# Altium project iron_board.PrjPcb
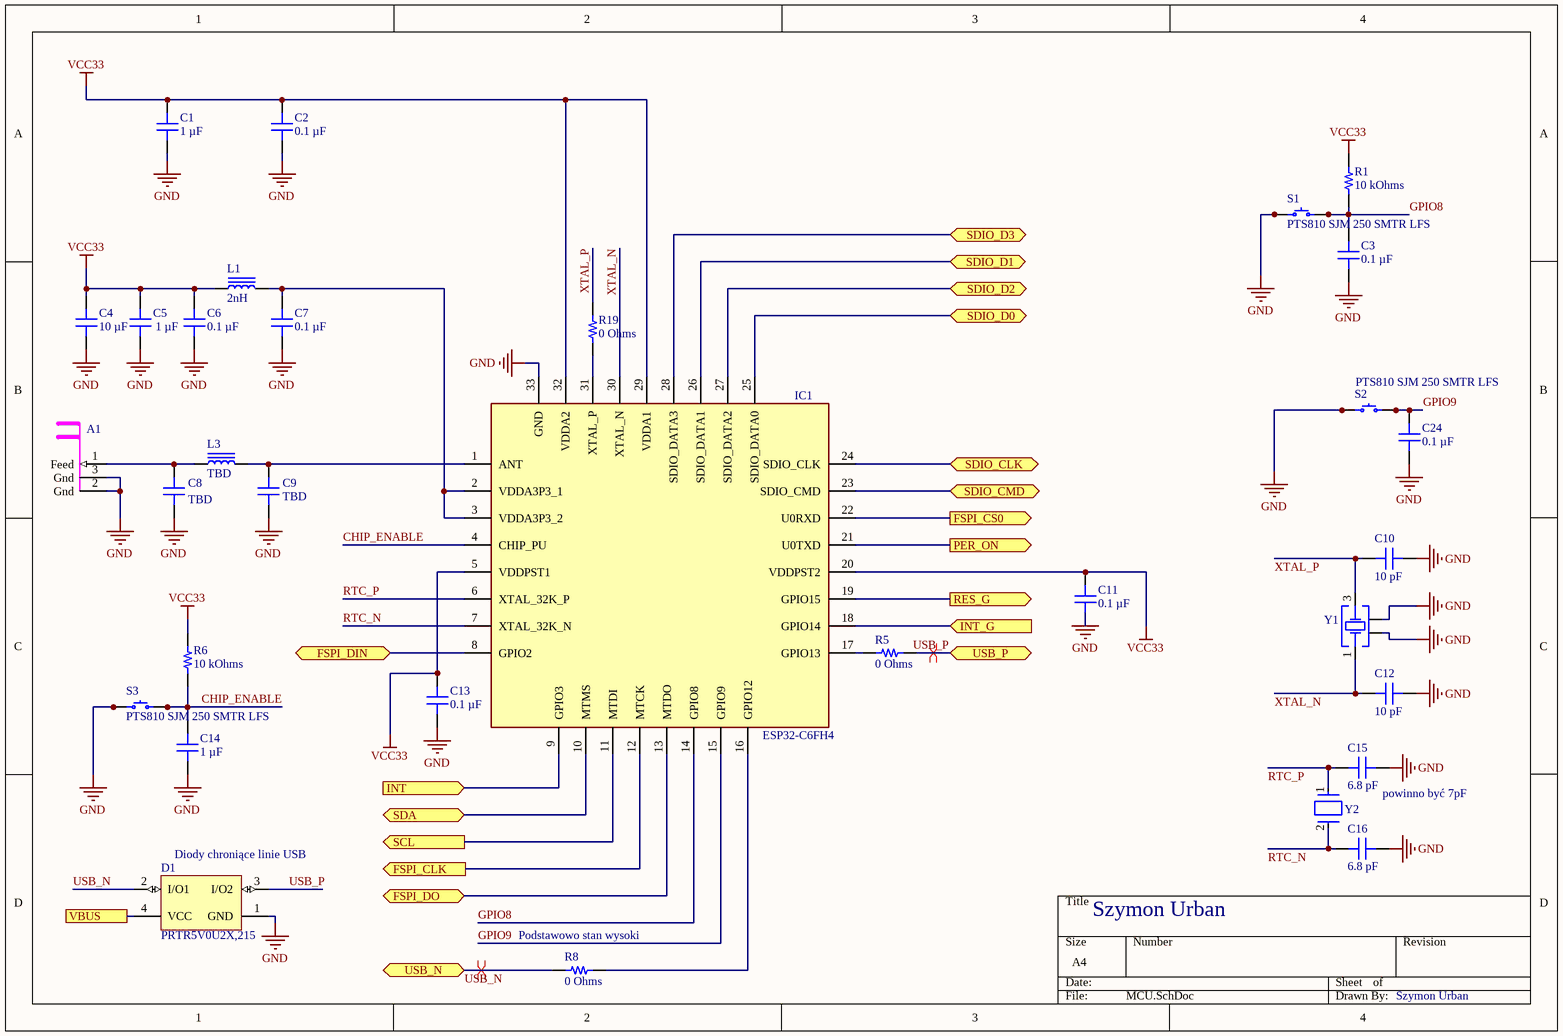
[diagram p0: MCU.SchDoc]
2 sheets, 76 parts. Net scope: flat (ports and power ports of the same name join across sheets).
Board file: iron_board_PCB.PcbDoc
Sheets:
  MCU.SchDoc
  peripherals.SchDoc

## Sheet MCU.SchDoc
size A4; SheetNumber: 1; SheetTotal: 2

### Parts
A1  Inverted F Antenna 2.4GHz  [IFA_2.4GHz]  (value not drawn)  (net tie, no BOM)
C1  1 µF  [CAP 0603_1608]
C2  0.1 µF  [CAP 0603_1608]
C3  0.1 µF  [CAP 0603_1608]
C4  10 µF  [CAP 0603_1608]
C5  1 µF  [CAP 0603_1608]
C6  0.1 µF  [CAP 0603_1608]
C7  0.1 µF  [CAP 0603_1608]
C8  TBD  [CAP 0402_1005]
C9  TBD  [CAP 0402_1005]
C10  10 pF  [CAP 0603_1608]
C11  0.1 µF  [CAP 0603_1608]
C12  10 pF  [CAP 0603_1608]
C13  0.1 µF  [CAP 0603_1608]
C14  1 µF  [CAP 0603_1608]
C15  6.8 pF  [CAP 0603_1608]
C16  6.8 pF  [CAP 0603_1608]
C24  0.1 µF  [CAP 0603_1608]
D1  PRTR5V0U2X,215  [NXP-SOT143B-4_V]
IC1  ESP32-C6FH4  [QFN50P500X500X90-33N]
L1  2nH  [IND 0603_1608 RF WW]
L3  TBD  [IND 0402_1005 RF WW]
R1  10 kOhms  [RES 0603_1608]
R5  0 Ohms  [RES 0603_1608]
R6  10 kOhms  [RES 0603_1608]
R8  0 Ohms  [RES 0603_1608]
R19  0 Ohms  [RES 0603_1608]
S1  PTS810 SJM 250 SMTR LFS  [C&K PTS810]
S2  PTS810 SJM 250 SMTR LFS  [C&K PTS810]
S3  PTS810 SJM 250 SMTR LFS  [C&K PTS810]
Y1  830108208709  [WE-XTAL_CFPX-218]  (value not drawn)
Y2  ABS07-32.768KHZ-7-1-T  [FP-ABS07-MFG]  (value not drawn)

### Ports
FSPI_CLK (out, see peripherals[2D]), FSPI_CS0 (out, see peripherals[2D]), FSPI_DIN (bidir, see peripherals[2D]), FSPI_DO (bidir, see peripherals[2D]), INT (in, see peripherals[4C]), INT_G (in, see peripherals[2C]), PER_ON (out, see peripherals[1D]), RES_G (out, see peripherals[2C]), SCL (out, see peripherals[2C], peripherals[3D]), SDA (bidir, see peripherals[2C], peripherals[3D]), SDIO_CLK (bidir, see peripherals[4B]), SDIO_CMD (bidir, see peripherals[4B]), SDIO_D0 (bidir, see peripherals[4A]), SDIO_D1 (bidir, see peripherals[4A]), SDIO_D2 (bidir, see peripherals[4A]), SDIO_D3 (bidir, see peripherals[4B]), USB_N (bidir, see peripherals[3A], peripherals[3B]), USB_P (bidir, see peripherals[3A], peripherals[3B]), VBUS (see peripherals[1A], peripherals[3A])

### Nets
GND: A1.2(Gnd) A1.3(Gnd) C1.1 C2.1 C3.1 C4.2 C5.1 C6.1 C7.1 C8.1 C9.1 C10.2 C11.1 C12.2 C13.1 C14.1 C15.2 C16.2 C24.1 D1.1(GND) IC1.33(GND) S1.1 S1.2 S2.1 S2.2 S3.1 S3.2 Y1.2(GND) Y1.4(GND)
VCC33: C1.2 C2.2 C4.1 C5.2 C6.2 C11.2 C13.2 IC1.5(VDDPST1) IC1.20(VDDPST2) IC1.29(VDDA1) IC1.32(VDDA2) L1.1 R1.2 R6.2
CHIP_ENABLE: C14.2 IC1.4(CHIP_PU) R6.1 S3.3 S3.4
GPIO8: C3.2 IC1.14(GPIO8) R1.1 S1.3 S1.4
GPIO9: C24.2 IC1.15(GPIO9) S2.3 S2.4
INT: IC1.9(GPIO3) ; port INT
INT_G: IC1.18(GPIO14) ; port INT_G
RTC_N: C16.1 IC1.7(XTAL_32K_N) Y2.2
RTC_P: C15.1 IC1.6(XTAL_32K_P) Y2.1
SCL: IC1.11(MTDI) ; port SCL
SDA: IC1.10(MTMS) ; port SDA
USB_N: D1.2(I/O1) R8.2 ; port USB_N
USB_P: D1.3(I/O2) R5.1 ; port USB_P
VBUS: D1.4(VCC) ; port VBUS
XTAL_N: C12.1 IC1.30(XTAL_N) Y1.1(Crystal)
XTAL_P: C10.1 R19.1 Y1.3(Crystal)
NetA1_1: A1.1(Feed) C8.2 L3.1
NetC7_2: C7.2 IC1.2(VDDA3P3_1) IC1.3(VDDA3P3_2) L1.2
NetC9_2: C9.2 IC1.1(ANT) L3.2
NetIC1_8: IC1.8(GPIO2) ; port FSPI_DIN
NetIC1_12: IC1.12(MTCK) ; port FSPI_CLK
NetIC1_13: IC1.13(MTDO) ; port FSPI_DO
NetIC1_16: IC1.16(GPIO12) R8.1
NetIC1_17: IC1.17(GPIO13) R5.2
NetIC1_19: IC1.19(GPIO15) ; port RES_G
NetIC1_21: IC1.21(U0TXD) ; port PER_ON
NetIC1_22: IC1.22(U0RXD) ; port FSPI_CS0
NetIC1_23: IC1.23(SDIO_CMD) ; port SDIO_CMD
NetIC1_24: IC1.24(SDIO_CLK) ; port SDIO_CLK
NetIC1_25: IC1.25(SDIO_DATA0) ; port SDIO_D0
NetIC1_26: IC1.26(SDIO_DATA1) ; port SDIO_D1
NetIC1_27: IC1.27(SDIO_DATA2) ; port SDIO_D2
NetIC1_28: IC1.28(SDIO_DATA3) ; port SDIO_D3
NetIC1_31: IC1.31(XTAL_P) R19.2

### Layout directives
differential pair; net class USB_P: USB_N
differential pair: USB_P

### Notes on the sheet
- (near C15) powinno być 7pF
- (near D1) Diody chroniące linie USB
- Szymon Urban
- (near R8) Podstawowo stan wysoki

### Library data of the parts
A1 = IFA_2.4GHz
C1 C5 C14 = CC0603KRX7R6BB105: CAP CER 1UF 10V X7R 0603; manufacturer: Yageo; Tolerance: ±10%; Part Number: CC0603KRX7R6BB105; Value: 1 µF; Applications: General Purpose; Capacitance: 1 µF; componentlink1description: Datasheet; componentlink1url: https://www.yageo.com/upload/media/product/productsearch/datasheet/mlcc/UPY-GPHC_X7R_6.3V-to-50V_18.pdf; componentlink2description: DigiKey Link; componentlink2url: https://www.digikey.com/en/products/detail/yageo/CC0603KRX7R6BB105/5195204; Device Package: 0603 (1608 Metric); lastupdated: 15.01.2024 20:10:05; Lifecycle Status: Active; Minimum Order: 1; Mounting Type: Surface Mount, MLCC; Operating Temperature: -55°C ~ 125°C; Package / Case: 0603 (1608 Metric); packaging: TapeAndReel; partid: 2290; Part Status: Active; price: 0.01; series: CC; Size / Dimension: 0.063" L x 0.031" W (1.60mm x 0.80mm); Supplier 1: DigiKey; Supplier Part Number 1: 311-1796-1-ND; Temperature Coefficient: X7R; Thickness (Max): 0.035" (0.90mm); Voltage - Rated: 10V
C2 C3 C6 C7 C11 C13 C24 = CS0603KRX7R7BB104: CAP CER 0.1UF 16V X7R 0603; manufacturer: Yageo; Tolerance: ±10%; Part Number: CS0603KRX7R7BB104; Value: 0.1 µF; Applications: Boardflex Sensitive; Capacitance: 0.1 µF; componentlink1description: Datasheet; componentlink1url: http://www.yageo.com/NewPortal/yageodocoutput?fileName=/pdf/MLCC/UPY-ST_NPOX7R_16V-to-3KV_5.pdf; componentlink2description: DigiKey Link; componentlink2url: https://www.digikey.com/en/products/detail/yageo/CS0603KRX7R7BB104/6097897; Device Package: 0603 (1608 Metric); Features: Soft Termination; lastupdated: 15.01.2024 20:10:05; Lifecycle Status: Active; Minimum Order: 1; Mounting Type: Surface Mount, MLCC; Operating Temperature: -55°C ~ 125°C; Package / Case: 0603 (1608 Metric); packaging: TapeAndReel; partid: 2286; Part Status: Active; price: 0.01; series: CS; Size / Dimension: 0.063" L x 0.031" W (1.60mm x 0.80mm); Supplier 1: DigiKey; Supplier Part Number 1: 311-3560-1-ND; Temperature Coefficient: X7R; Thickness (Max): 0.037" (0.95mm); Voltage - Rated: 16V
C4 = GRM188D71A106KA73D: CAP CER 10UF 10V X7T 0603; manufacturer: Murata Electronics; Tolerance: ±10%; Part Number: GRM188D71A106KA73D; Value: 10 µF; Applications: General Purpose; Capacitance: 10 µF; componentlink1description: Datasheet; componentlink1url: https://search.murata.co.jp/Ceramy/image/img/A01X/G101/ENG/GRM188D71A106KA73-01.pdf; componentlink2description: DigiKey Link; componentlink2url: https://www.digikey.com/en/products/detail/murata-electronics/GRM188D71A106KA73D/6606090; Device Package: 0603 (1608 Metric); lastupdated: 15.01.2024 20:10:04; Lifecycle Status: Active; Minimum Order: 1; Mounting Type: Surface Mount, MLCC; Operating Temperature: -55°C ~ 125°C; Package / Case: 0603 (1608 Metric); packaging: TapeAndReel; partid: 2489; Part Status: Active; price: 0.03; series: GRM; Size / Dimension: 0.063" L x 0.031" W (1.60mm x 0.80mm); Supplier 1: DigiKey; Supplier Part Number 1: 490-14461-1-ND; Temperature Coefficient: X7T; Thickness (Max): 0.039" (1.00mm); Voltage - Rated: 10V
C8 C9 = 04023A6R8CAT2A: CAP CER 6.8PF 25V C0G/NP0 0402; manufacturer: AVX Corporation; Temperature Coefficient: C0G, NP0; Tolerance: ±0.25pF; Part Number: 04023A6R8CAT2A; Value: TBD; Applications: General Purpose; componentlink1description: Datasheet; componentlink1url: http://datasheets.avx.com/C0GNP0-Dielectric.pdf; componentlink2description: DigiKey Link; componentlink2url: http://digikey.com/product-detail/en/avx-corporation/04023A6R8CAT2A/478-12617-1-ND/9949155; Device Package: 0402 (1005 Metric); lastupdated: 08.02.2022 12:26:50; Lifecycle Status: Active; Minimum Order: 1; Mounting Type: Surface Mount, MLCC; Operating Temperature: -55°C ~ 125°C; Package / Case: 0402 (1005 Metric); packaging: TapeAndReel; partid: 6987; Part Status: Active; price: 0.06; series: -; Size / Dimension: 0.039" L x 0.020" W (1.00mm x 0.50mm); Supplier 1: DigiKey; Supplier Part Number 1: 478-12617-1-ND; Thickness (Max): 0.022" (0.56mm); Voltage - Rated: 25V
  C8: Capacitance: TBD
  C9: Capacitance: 6.8pF
C10 C12 = VJ0603A100FXACW1BC: CAP CER 10PF 50V C0G/NP0 0603; manufacturer: Vishay Vitramon; Temperature Coefficient: C0G, NP0; Tolerance: ±1%; Part Number: VJ0603A100FXACW1BC; Value: 10 pF; Applications: General Purpose; Capacitance: 10 pF; componentlink1description: Datasheet; componentlink1url: https://www.vishay.com/docs/28548/vjw1bcbascomseries.pdf; componentlink2description: DigiKey Link; componentlink2url: https://www.digikey.com/en/products/detail/vishay-vitramon/VJ0603A100FXACW1BC/8302770; Device Package: 0603 (1608 Metric); lastupdated: 15.01.2024 20:09:38; Lifecycle Status: Active; Minimum Order: 1; Mounting Type: Surface Mount, MLCC; Operating Temperature: -55°C ~ 125°C; Package / Case: 0603 (1608 Metric); packaging: TapeAndReel; partid: 42121; Part Status: Active; price: 0.01; series: VJ W1BC; Size / Dimension: 0.063" L x 0.031" W (1.60mm x 0.80mm); Supplier 1: DigiKey; Supplier Part Number 1: 720-VJ0603A100FXACW1BCCT-ND; Thickness (Max): 0.034" (0.87mm); Voltage - Rated: 50V
C15 C16 = GQM1875C2E6R8WB12D: CAP CER 6.8PF 250V C0G/NP0 0603; manufacturer: Murata Electronics; Temperature Coefficient: C0G, NP0; Tolerance: ±0.05pF; Part Number: GQM1875C2E6R8WB12D; Value: 6.8 pF; Applications: RF, Microwave, High Frequency; Capacitance: 6.8 pF; componentlink1description: Datasheet; componentlink1url: https://search.murata.co.jp/Ceramy/image/img/A01X/G101/ENG/GQM1875C2E6R8WB12-01.pdf; componentlink2description: DigiKey Link; componentlink2url: https://www.digikey.com/en/products/detail/murata-electronics/GQM1875C2E6R8WB12D/16033646; Device Package: 0603 (1608 Metric); Features: High Q, Low Loss; lastupdated: 15.01.2024 20:09:09; Lifecycle Status: Active; Minimum Order: 1; Mounting Type: Surface Mount, MLCC; Operating Temperature: -55°C ~ 125°C; Package / Case: 0603 (1608 Metric); packaging: TapeAndReel; partid: 50061; Part Status: Active; price: 0.11; series: GQM; Size / Dimension: 0.063" L x 0.031" W (1.60mm x 0.80mm); Supplier 1: DigiKey; Supplier Part Number 1: 490-GQM1875C2E6R8WB12DCT-ND; Thickness (Max): 0.031" (0.80mm); Voltage - Rated: 250V
D1 = CMP-2000-05285-1: Ultra Low Capacitance Double Rail-to-Rail ESD Protection Diode, 5.5 V, 1 pF, -40 to 85 degC, 4-Pin SOT143B, RoHS, Tape and Reel; Manufacturer: NXP Semiconductors; Capacitance Value: 16pF; Number of Elements: 1; Rad Hardened: No; Reverse Breakdown Voltage: 6V; Working Voltage (Max): 5.5V; Polarity: Uni-Directional; Configuration: Quad; Leakage Current: 0.1uA; Product Height (mm): 1mm; Suppressor Type: DiodeArrays; Product Length (mm): 3mm; Product Depth (mm): 1.4mm; ESD Protection Voltage: 8KV@ContactDisc; Package Type: SOT; Mounting: SurfaceMount; Packaging: TapeandReel; Datasheet Version: Rev. 02, 01/2008; Reverse Stand-off Voltage: 5.5V; Manufacturer URL: http://www.nxp.com/; Operating Temp Range: -40Cto85C; Operating Temperature Classification: Industrial; Working Voltage: 5.5V; Operating Temperature Min Deg. C: -40C; Datasheet URL: https://datasheet.ciiva.com/4479/prtr5v0u2x-102853-4479461.pdf; Leakage Current (Max): 0.1uA; Direction Type: Uni-Directional; Pin Count: 3+Tab; Operating Temperature Max Deg. C: 85C; Mounting Style: SurfaceMount; Package / Case: SOT
IC1 = ESP32-C6FH4: Integrated Circuit; Manufacturer_Name: Espressif Systems; Datasheet Link: https://www.mouser.ch/ProductDetail/Espressif-Systems/ESP32-C6FH4?qs=sGAEpiMZZMu3sxpa5v1qriveB5Rxa06Y9iJOmwW58jU%3D; Height: 0.9mm; Manufacturer_Part_Number: ESP32-C6FH4; Mouser Part Number: 356-ESP32-C6FH4; Mouser Price/Stock: https://www.mouser.co.uk/ProductDetail/Espressif-Systems/ESP32-C6FH4?qs=Imq1NPwxi77uZvg%252BuAIiXA%3D%3D
L1 = 744761020A: FIXED IND 2NH 700MA 80 MOHM SMD; Manufacturer: Würth Elektronik; DC Resistance (DCR): 80mOhm Max; Frequency - Self Resonant: 6.9GHz; Inductance Frequency - Test: 250MHz; Material - Core: Ceramic; Q @ Freq: 16 @ 250MHz; Shielding: Unshielded; Tolerance: ±0.2nH; Type: Wirewound; Part Number: 744761020A; ComponentLink1Description: Datasheet; ComponentLink1URL: https://katalog.we-online.com/pbs/datasheet/744761020A.pdf; ComponentLink2Description: DigiKey Link; ComponentLink2URL: http://digikey.com/product-detail/en/w-rth-elektronik/744761020A/732-744761020ACT-ND/10668665; Current Rating (Amps): 700mA; Device Package: 0603 (1608 Metric); Inductance: 2nH; LastUpdated: 06.09.2020 11:05:18; Lifecycle Status: Active; Minimum Order: 1; Mounting Type: Surface Mount; Operating Temperature: -40°C ~ 125°C; Package / Case: 0603 (1608 Metric); Packaging: Unknown; PartId: 1038; Part Status: Active; Price: 0.18; Series: WE-KI; Supplier 1: DigiKey; Supplier Part Number 1: 732-744761020ACT-ND; Supplier Device Package: 0603; Value: 2nH
L3 = LQW18ASR39J00D: FIXED IND 390NH 100MA 4.35OHM SM; Manufacturer: Murata Electronics; DC Resistance (DCR): 4.35Ohm Max; Frequency - Self Resonant: 900MHz; Inductance Frequency - Test: 100 MHz; Material - Core: Non-Magnetic; Q @ Freq: 25 @ 100MHz; Shielding: Unshielded; Tolerance: ±5%; Type: Wirewound; Part Number: LQW18ASR39J00D; ComponentLink2Description: DigiKey Link; ComponentLink2URL: https://www.digikey.com/en/products/detail/murata-electronics/LQW18ASR39J00D/10702651; Current Rating (Amps): 100 mA; Device Package: 0603 (1608 Metric); Height - Seated (Max): 0.039" (1.00mm); Inductance: 390 nH; LastUpdated: 15.01.2024 21:33:43; Lifecycle Status: Active; Minimum Order: 1; Mounting Type: Surface Mount; Operating Temperature: -40°C ~ 125°C; Package / Case: 0603 (1608 Metric); Packaging: TapeAndReel; PartId: 1604; Part Status: Active; Price: 0.05; Series: LQW15; Size / Dimension: 0.063" L x 0.031" W (1.60mm x 0.80mm); Supplier 1: DigiKey; Supplier Part Number 1: 490-LQW18ASR39J00DCT-ND; Supplier Device Package: 0603; Value: TBD
R1 R6 = RT0603FRE0710KL: RES SMD 10K OHM 1% 1/10W 0603; Manufacturer: Yageo; Power (Watts): 0.1W, 1/10W; Temperature Coefficient: ±50ppm/°C; Part Number: RT0603FRE0710KL; Value: 10 kOhms; ComponentLink1Description: Datasheet; ComponentLink1URL: https://www.yageo.com/upload/media/product/productsearch/datasheet/rchip/PYu-RT_1-to-0.01_RoHS_L_11.pdf; ComponentLink2Description: DigiKey Link; ComponentLink2URL: https://www.digikey.com/en/products/detail/yageo/RT0603FRE0710KL/1075040; Composition: Thin Film; Device Package: 0603 (1608 Metric); Height - Seated (Max): 0.022" (0.55mm); LastUpdated: 15.01.2024 20:40:25; Lifecycle Status: Active; Minimum Order: 1; Number of Terminations: 2; Operating Temperature: -55°C ~ 155°C; Package / Case: 0603 (1608 Metric); Packaging: TapeAndReel; PartId: 5671; Part Status: Active; Price: 0.01; Resistance: 10 kOhms; Series: RT; Size / Dimension: 0.063" L x 0.031" W (1.60mm x 0.80mm); Supplier 1: DigiKey; Supplier Part Number 1: YAG2321CT-ND; Supplier Device Package: 0603; Tolerance: ±1%
R5 R8 R19 = JR0603X26E: 0603 26 AMP JUMPER; Manufacturer: Ohmite; Power (Watts): 0.135W; Part Number: JR0603X26E; Value: 0 Ohms; ComponentLink1Description: Datasheet; ComponentLink1URL: https://www.ohmite.com/assets/docs/res_jr.pdf?r=false; ComponentLink2Description: DigiKey Link; ComponentLink2URL: https://www.digikey.com/en/products/detail/ohmite/JR0603X26E/10233371; Composition: Metal Element; Device Package: 0603 (1608 Metric); Height - Seated (Max): 0.022" (0.55mm); LastUpdated: 15.01.2024 20:40:20; Lifecycle Status: Active; Minimum Order: 1; Number of Terminations: 2; Operating Temperature: -55°C ~ 150°C; Package / Case: 0603 (1608 Metric); Packaging: TapeAndReel; PartId: 6812; Part Status: Active; Price: 0.10; Resistance: 0 Ohms; Series: JR; Size / Dimension: 0.063" L x 0.031" W (1.60mm x 0.80mm); Supplier 1: DigiKey; Supplier Part Number 1: JR0603X26ECT-ND; Supplier Device Package: 0603; Tolerance: Jumper
S1-S3 = PTS810 SJM 250 SMTR LFS: SWITCH TACTILE SPST-NO 0.05A 16V; Manufacturer: C&K; Actuator Height off PCB, Vertical: 2.50mm; Actuator Orientation: Top Actuated; Actuator Type: Oval Button; Contact Rating @ Voltage: 0.05A @ 16VDC; Illumination: Non-Illuminated; Operating Force: 160gf; Outline: 4.20mm x 3.20mm; Switch Function: Off-Mom; Part Number: PTS810 SJM 250 SMTR LFS; Circuit: SPST-NO; ComponentLink1Description: Datasheet; ComponentLink1URL: https://dznh3ojzb2azq.cloudfront.net/products/Tactile/PTS810/documents/datasheet.pdf; ComponentLink2Description: DigiKey Link; ComponentLink2URL: http://digikey.com/product-detail/en/c-k/PTS810-SJM-250-SMTR-LFS/CKN10502CT-ND/4176673; LastUpdated: 09.04.2020 10:00:13; Lifecycle Status: Active; Minimum Order: 1; Mounting Type: Surface Mount; Operating Temperature: -40°C ~ 85°C; Packaging: TapeAndReel; Part Status: Active; Price: 0.16; Series: PTS810; Supplier 1: DigiKey; Supplier Part Number 1: CKN10502CT-ND; Termination Style: J Lead
Y1 = CMP-03913-116855769-1: 830108208709 WE-XTAL Quartz Crystal; Frequency: 40MHz; Width: 2mm; Max Operating Temperature: 70°C; Height: 600µm; Min Operating Temperature: -20°C; NexarPartId: 116855769; Length: 2.5mm
Y2 = CMP-27762-015873-1: Crystal 32.768kHz ±10ppm (Tol) 7pF FUND 70kΩ 2-Pin CSMD T/R; ESR (Equivalent Series Resistance): 70kR; Min Operating Temperature: -40°C; Height: 0.035inch; Max Operating Temperature: 85°C; Length: 0.126inch; RoHS Compliant: Yes; Width: 0.061inch; Frequency Tolerance: 10ppm; Lead Free: Lead Free; Operating Frequency: 32.768 kHz; Packaging: Cut Tape; Series: ABS07; Case/Package: SMD/SMT; Frequency: 32.768kHz; Load Capacitance: 7pF; Mount: Surface Mount

## Sheet peripherals.SchDoc
size A4; SheetNumber: 2; SheetTotal: 2
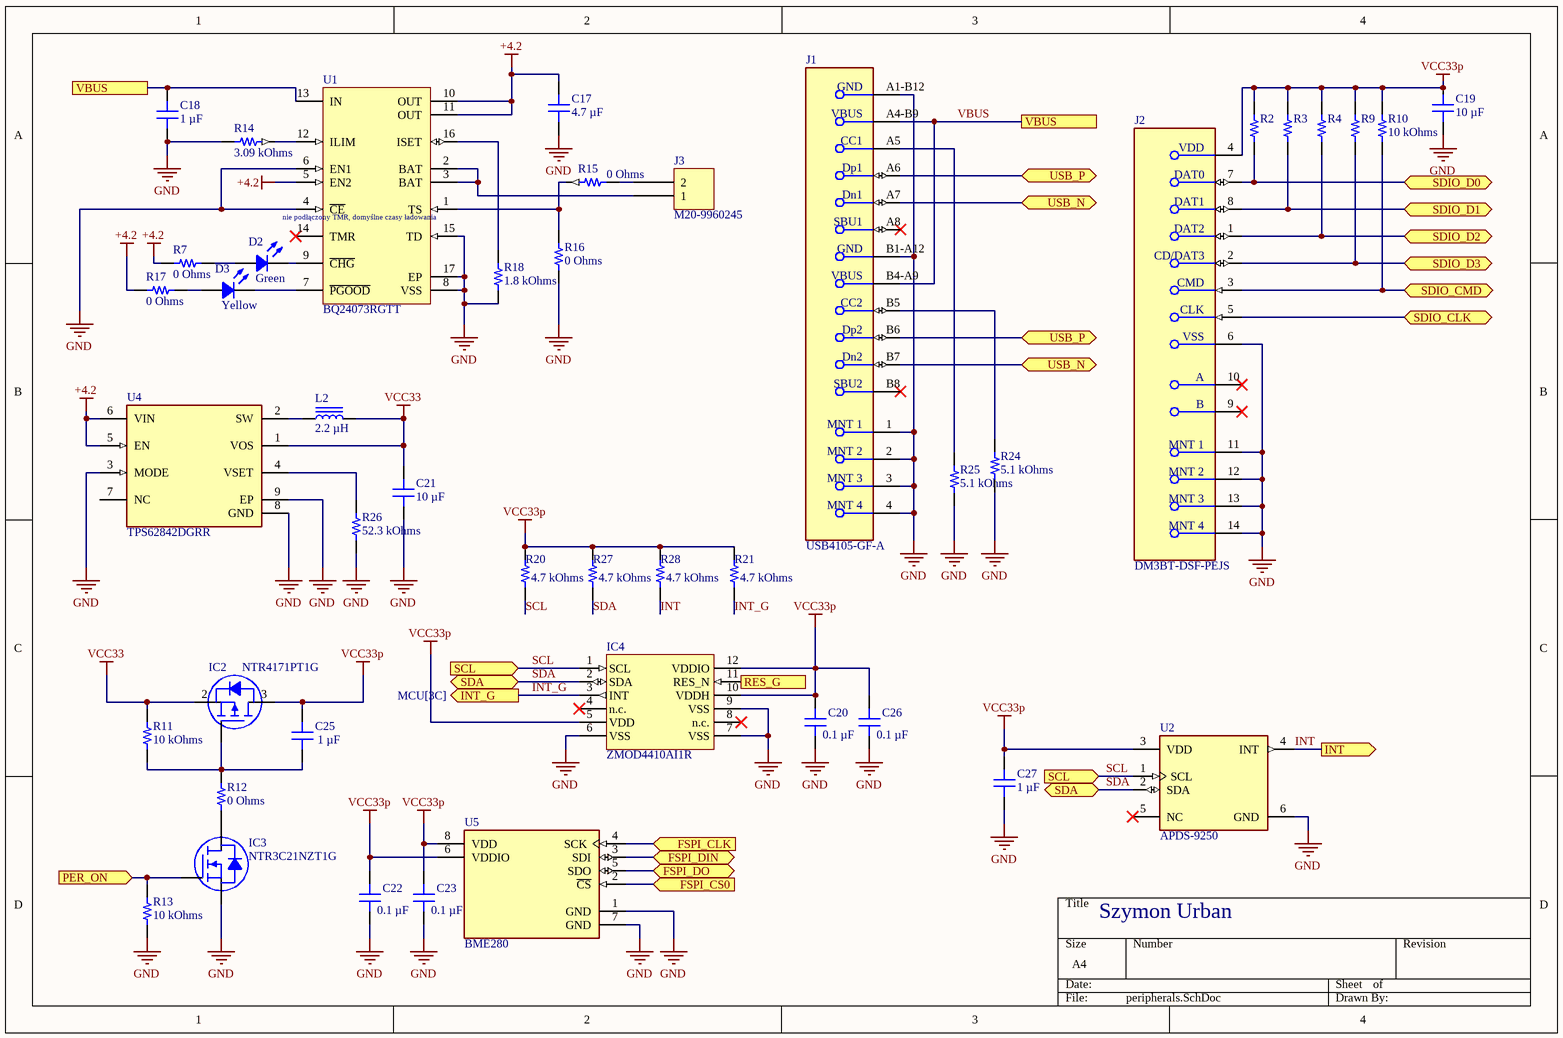
[diagram p1: peripherals.SchDoc]

### Parts
C17  4.7 µF  [CAP 0603_1608]
C18  1 µF  [CAP 0603_1608]
C19  10 µF  [CAP 0603_1608]
C20  0.1 µF  [CAP 0603_1608]
C21  10 µF  [CAP 0603_1608]
C22  0.1 µF  [CAP 0603_1608]
C23  0.1 µF  [CAP 0603_1608]
C25  1 µF  [CAP 0603_1608]
C26  0.1 µF  [CAP 0603_1608]
C27  1 µF  [CAP 0603_1608]
D2  Green  [LED 0805_2012 GREEN]
D3  Yellow  [LED 0805_2012 YELLOW]
IC2  NTR4171PT1G  [ON SEMI SOT-23-3]
IC3  NTR3C21NZT1G  [ON SEMI SOT-23-3]
IC4  ZMOD4410AI1R  [ZMODxxxx 12 Leads- LGG12]
J1  USB4105-GF-A  [FP-USB4105-GF-A-MFG]
J2  DM3BT-DSF-PEJS  [FP-DM3BT-DSF-PEJS-MFG]
J3  M20-9960245  [HARWIN M20-9960245]
L2  2.2 µH  [IND 0806_2016]
R2  10 kOhms  [RES 0603_1608]  (value not drawn)
R3  10 kOhms  [RES 0603_1608]  (value not drawn)
R4  10 kOhms  [RES 0603_1608]  (value not drawn)
R7  0 Ohms  [RES 0603_1608]
R9  10 kOhms  [RES 0603_1608]  (value not drawn)
R10  10 kOhms  [RES 0603_1608]
R11  10 kOhms  [RES 0603_1608]
R12  0 Ohms  [RES 0603_1608]
R13  10 kOhms  [RES 0603_1608]
R14  3.09 kOhms  [RES 0603_1608]
R15  0 Ohms  [RES 0603_1608]
R16  0 Ohms  [RES 0603_1608]
R17  0 Ohms  [RES 0603_1608]
R18  1.8 kOhms  [RES 0603_1608]
R20  4.7 kOhms  [RES 0603_1608]
R21  4.7 kOhms  [RES 0603_1608]
R24  5.1 kOhms  [RES 0603_1608]
R25  5.1 kOhms  [RES 0603_1608]
R26  52.3 kOhms  [RES 0603_1608]
R27  4.7 kOhms  [RES 0603_1608]
R28  4.7 kOhms  [RES 0603_1608]
U1  BQ24073RGTT  [RGT0016C_V]
U2  APDS-9250  [FP-APDS-9250-MFG]
U4  TPS62842DGRR  [FP-DGR0008A-MFG]
U5  BME280  [FP-BME280-MFG]

### Ports
FSPI_CLK (in, see MCU[1D]), FSPI_CS0 (in, see MCU[3C]), FSPI_DIN (bidir, see MCU[1C]), FSPI_DO (bidir, see MCU[1D]), INT (out, see MCU[1D]), INT_G (out, see MCU[3C]), PER_ON (in, see MCU[3C]), RES_G (in, see MCU[3C]), SCL (in, see MCU[1D], peripherals[2C]), SCL (in, see MCU[1D], peripherals[3D]), SDA (bidir, see MCU[1D], peripherals[2C]), SDA (bidir, see MCU[1D], peripherals[3D]), SDIO_CLK (bidir, see MCU[3B]), SDIO_CMD (bidir, see MCU[3B]), SDIO_D0 (bidir, see MCU[3B]), SDIO_D1 (bidir, see MCU[3B]), SDIO_D2 (bidir, see MCU[3B]), SDIO_D3 (bidir, see MCU[3A]), USB_N (bidir, see MCU[1D], peripherals[3A]), USB_N (bidir, see MCU[1D], peripherals[3B]), USB_P (bidir, see MCU[3C], peripherals[3A]), USB_P (bidir, see MCU[3C], peripherals[3B]), VBUS (see MCU[1D], peripherals[1A]), VBUS (see MCU[1D], peripherals[3A])

### Nets
+4.2: C17.2 R7.2 R17.2 U1.5(EN2) U1.10(OUT) U1.11(OUT) U4.5(EN) U4.6(VIN)
GND: C17.1 C18.1 C19.2 C20.1 C21.2 C22.1 C23.1 C26.1 C27.1 IC3.2(S) IC4.6(VSS) IC4.7(VSS) IC4.9(VSS) J1.1(MNT_1) J1.2(MNT_2) J1.3(MNT_3) J1.4(MNT_4) J1.A1-B12(GND) J1.B1-A12(GND) J2.6(VSS) J2.11(MNT_1) J2.12(MNT_2) J2.13(MNT_3) J2.14(MNT_4) R13.1 R14.1 R16.1 R18.1 R24.1 R25.1 R26.1 U1.4(~{CE}) U1.6(EN1) U1.8(VSS) U1.15(TD) U1.17(EP) U2.6(GND) U4.3(MODE) U4.8(GND) U4.9(EP) U5.1(GND) U5.7(GND)
VCC33: C21.1 IC2.2(S) L2.2 R11.2 U4.1(VOS)
VCC33p: C19.1 C20.2 C22.2 C23.2 C25.2 C26.2 C27.2 IC2.3(D) IC4.5(VDD) IC4.10(VDDH) IC4.12(VDDIO) J2.4(VDD) R2.2 R3.2 R4.2 R9.2 R10.2 R20.1 R21.1 R27.1 R28.1 U2.3(VDD) U5.6(VDDIO) U5.8(VDD)
INT: R28.2 U2.4(INT) ; port INT
INT_G: IC4.3(INT) R21.2 ; port INT_G
SCL: IC4.1(SCL) R20.2 U2.1(SCL) ; port SCL
SDA: IC4.2(SDA) R27.2 U2.2(SDA) ; port SDA
USB_N: J1.A7(Dn1) J1.B7(Dn2) ; port USB_N
USB_P: J1.A6(Dp1) J1.B6(Dp2) ; port USB_P
VBUS: C18.2 J1.A4-B9(VBUS) J1.B4-A9(VBUS) U1.13(IN) ; port VBUS
NetC25_1: C25.1 IC2.1(G) R11.1 R12.2
NetD2_1: D2.1 R7.1
NetD2_2: D2.2 U1.9(~{CHG})
NetD3_1: D3.1 R17.1
NetD3_2: D3.2 U1.7(~{PGOOD})
NetIC1_8: U5.3(SDI) ; port FSPI_DIN
NetIC1_12: U5.4(SCK) ; port FSPI_CLK
NetIC1_13: U5.5(SDO) ; port FSPI_DO
NetIC1_19: IC4.11(RES_N) ; port RES_G
NetIC1_21: IC3.1(G) R13.2 ; port PER_ON
NetIC1_22: U5.2(~{CS}) ; port FSPI_CS0
NetIC1_23: J2.3(CMD) R10.1 ; port SDIO_CMD
NetIC1_24: J2.5(CLK) ; port SDIO_CLK
NetIC1_25: J2.7(DAT0) R2.1 ; port SDIO_D0
NetIC1_26: J2.8(DAT1) R3.1 ; port SDIO_D1
NetIC1_27: J2.1(DAT2) R4.1 ; port SDIO_D2
NetIC1_28: J2.2(CD/DAT3) R9.1 ; port SDIO_D3
NetIC3_3: IC3.3(D) R12.1
NetJ1_A5: J1.A5(CC1) R25.2
NetJ1_B5: J1.B5(CC2) R24.2
NetJ3_1: J3.1 U1.2(BAT) U1.3(BAT)
NetJ3_2: J3.2 R15.2
NetL2_1: L2.1 U4.2(SW)
NetR14_2: R14.2 U1.12(ILIM)
NetR15_1: R15.1 R16.2 U1.1(TS)
NetR18_2: R18.2 U1.16(ISET)
NetR26_2: R26.2 U4.4(VSET)

Not connected (* = marked no-connect by the designer): IC4 4(n.c.)* 8(n.c.)*; J1 A8(SBU1)* B8(SBU2)*; J2 9(B)* 10(A)*; U1 14(TMR)*; U2 5(NC)*; U4 7(NC)

### Notes on the sheet
- (near U1) nie podłączony TMR, domyślne czasy ładowania
- Szymon Urban

### Library data of the parts
C17 = GRM188R61C475KE11D: CAP CER 4.7UF 16V X5R 0603; manufacturer: Murata Electronics; Tolerance: ±10%; Part Number: GRM188R61C475KE11D; Value: 4.7 µF; Applications: General Purpose; Capacitance: 4.7 µF; componentlink1description: Datasheet; componentlink1url: https://search.murata.co.jp/Ceramy/image/img/A01X/G101/ENG/GRM188R61C475KE11-01.pdf; componentlink2description: DigiKey Link; componentlink2url: https://www.digikey.com/en/products/detail/murata-electronics/GRM188R61C475KE11D/4905341; Device Package: 0603 (1608 Metric); lastupdated: 15.01.2024 20:10:04; Lifecycle Status: Active; Minimum Order: 1; Mounting Type: Surface Mount, MLCC; Operating Temperature: -55°C ~ 85°C; Package / Case: 0603 (1608 Metric); packaging: TapeAndReel; partid: 2388; Part Status: Active; price: 0.03; series: GRM; Size / Dimension: 0.063" L x 0.031" W (1.60mm x 0.80mm); Supplier 1: DigiKey; Supplier Part Number 1: 490-10730-1-ND; Temperature Coefficient: X5R; Thickness (Max): 0.037" (0.95mm); Voltage - Rated: 16V
C18 C25 C27 = CC0603KRX7R6BB105: as C1 on sheet MCU; Part Number: CC0603KRX7R6BB105; Value: 1 µF; Applications: General Purpose; Capacitance: 1 µF; componentlink1description: Datasheet; componentlink1url: https://www.yageo.com/upload/media/product/productsearch/datasheet/mlcc/UPY-GPHC_X7R_6.3V-to-50V_18.pdf; componentlink2description: DigiKey Link; componentlink2url: https://www.digikey.com/en/products/detail/yageo/CC0603KRX7R6BB105/5195204; Device Package: 0603 (1608 Metric); lastupdated: 15.01.2024 20:10:05; Lifecycle Status: Active; Minimum Order: 1; Mounting Type: Surface Mount, MLCC; Operating Temperature: -55°C ~ 125°C; Package / Case: 0603 (1608 Metric); packaging: TapeAndReel; partid: 2290; Part Status: Active; price: 0.01; series: CC; Size / Dimension: 0.063" L x 0.031" W (1.60mm x 0.80mm); Supplier 1: DigiKey; Supplier Part Number 1: 311-1796-1-ND; Temperature Coefficient: X7R; Thickness (Max): 0.035" (0.90mm); Voltage - Rated: 10V
C19 C21 = GRM188D71A106KA73D: as C4 on sheet MCU; Part Number: GRM188D71A106KA73D; Value: 10 µF; Applications: General Purpose; Capacitance: 10 µF; componentlink1description: Datasheet; componentlink1url: https://search.murata.co.jp/Ceramy/image/img/A01X/G101/ENG/GRM188D71A106KA73-01.pdf; componentlink2description: DigiKey Link; componentlink2url: https://www.digikey.com/en/products/detail/murata-electronics/GRM188D71A106KA73D/6606090; Device Package: 0603 (1608 Metric); lastupdated: 15.01.2024 20:10:04; Lifecycle Status: Active; Minimum Order: 1; Mounting Type: Surface Mount, MLCC; Operating Temperature: -55°C ~ 125°C; Package / Case: 0603 (1608 Metric); packaging: TapeAndReel; partid: 2489; Part Status: Active; price: 0.03; series: GRM; Size / Dimension: 0.063" L x 0.031" W (1.60mm x 0.80mm); Supplier 1: DigiKey; Supplier Part Number 1: 490-14461-1-ND; Temperature Coefficient: X7T; Thickness (Max): 0.039" (1.00mm); Voltage - Rated: 10V
C20 C22 C23 C26 = CS0603KRX7R7BB104: as C2 on sheet MCU; Part Number: CS0603KRX7R7BB104; Value: 0.1 µF; Applications: Boardflex Sensitive; Capacitance: 0.1 µF; componentlink1description: Datasheet; componentlink1url: http://www.yageo.com/NewPortal/yageodocoutput?fileName=/pdf/MLCC/UPY-ST_NPOX7R_16V-to-3KV_5.pdf; componentlink2description: DigiKey Link; componentlink2url: https://www.digikey.com/en/products/detail/yageo/CS0603KRX7R7BB104/6097897; Device Package: 0603 (1608 Metric); Features: Soft Termination; lastupdated: 15.01.2024 20:10:05; Lifecycle Status: Active; Minimum Order: 1; Mounting Type: Surface Mount, MLCC; Operating Temperature: -55°C ~ 125°C; Package / Case: 0603 (1608 Metric); packaging: TapeAndReel; partid: 2286; Part Status: Active; price: 0.01; series: CS; Size / Dimension: 0.063" L x 0.031" W (1.60mm x 0.80mm); Supplier 1: DigiKey; Supplier Part Number 1: 311-3560-1-ND; Temperature Coefficient: X7R; Thickness (Max): 0.037" (0.95mm); Voltage - Rated: 16V
D2 = 150080VS75000: LED GREEN CLEAR 0805 SMD; Manufacturer: Würth Elektronik; Configuration: Standard; Current - Test: 20mA; Lens Color: Colorless; Lens Size: 1.40mm x 1.25mm; Lens Style: Rectangle with Flat Top; Millicandela Rating: 40mcd; Viewing Angle: 140°; Voltage - Forward (Vf) (Typ): 2V; Wavelength - Dominant: 570nm; Wavelength - Peak: 572nm; Part Number: 150080VS75000; Color: Green; ComponentLink1Description: Datasheet; ComponentLink1URL: https://katalog.we-online.de/led/datasheet/150080VS75000.pdf; ComponentLink2Description: DigiKey Link; ComponentLink2URL: https://www.digikey.com/en/products/detail/würth-elektronik/150080VS75000/4489924; Device Package: 0805 (2012 Metric); Height (Max): 0.80mm; LastUpdated: 15.01.2024 21:31:06; Lens Transparency: Clear; Lifecycle Status: Active; Minimum Order: 1; Mounting Type: Surface Mount; Package / Case: 0805 (2012 Metric); Packaging: TapeAndReel; PartId: 300; Part Status: Active; Price: 0.13; Series: WL-SMCW; Size / Dimension: 2.00mm L x 1.25mm W; Supplier 1: DigiKey; Supplier Part Number 1: 732-4986-1-ND; Supplier Device Package: 0805; Value: Green
D3 = 150080YS75000: LED YELLOW CLEAR 0805 SMD; Manufacturer: Würth Elektronik; Configuration: Standard; Current - Test: 20mA; Lens Color: Colorless; Lens Size: 1.40mm x 1.25mm; Lens Style: Rectangle with Flat Top; Millicandela Rating: 120mcd; Viewing Angle: 140°; Voltage - Forward (Vf) (Typ): 2V; Wavelength - Dominant: 590nm; Wavelength - Peak: 595nm; Part Number: 150080YS75000; Color: Yellow; ComponentLink1Description: Datasheet; ComponentLink1URL: https://katalog.we-online.de/led/datasheet/150080YS75000.pdf; ComponentLink2Description: DigiKey Link; ComponentLink2URL: https://www.digikey.com/en/products/detail/würth-elektronik/150080YS75000/4489927; Device Package: 0805 (2012 Metric); Height (Max): 0.80mm; LastUpdated: 15.01.2024 21:32:02; Lens Transparency: Clear; Lifecycle Status: Active; Minimum Order: 1; Mounting Type: Surface Mount; Package / Case: 0805 (2012 Metric); Packaging: TapeAndReel; PartId: 56; Part Status: Active; Price: 0.13; Series: WL-SMCW; Size / Dimension: 2.00mm L x 1.25mm W; Supplier 1: DigiKey; Supplier Part Number 1: 732-4987-1-ND; Supplier Device Package: 0805; Value: Yellow
IC2 = NTR4171PT1G: MOSFET P-CH 30V 2.2A SOT23; Manufacturer: ON Semiconductor; Current - Continuous Drain (Id) @ 25°C: 2.2A (Ta); Drive Voltage (Max Rds On,  Min Rds On): 2.5V, 10V; FET Type: P-Channel; Gate Charge (Qg) (Max) @ Vgs: 15.6nC @ 10V; Input Capacitance (Ciss) (Max) @ Vds: 720pF @ 15V; Power Dissipation (Max): 480mW (Ta); Rds On (Max) @ Id, Vgs: 75mOhm @ 2.2A, 10V; Vgs (Max): ±12V; Vgs(th) (Max) @ Id: 1.4V @ 250µA; Part Number: NTR4171PT1G; ComponentLink1Description: Datasheet; ComponentLink1URL: http://www.onsemi.com/pub/Collateral/NTR4171P-D.PDF; ComponentLink2Description: DigiKey Link; ComponentLink2URL: http://digikey.com/product-detail/en/on-semiconductor/NTR4171PT1G/NTR4171PT1GOSCT-ND/2705209; Drain to Source Voltage (Vdss): 30V; LastUpdated: 08.02.2024 21:46:19; Lifecycle Status: Active; Minimum Order: 1; Mounting Type: Surface Mount; Operating Temperature: -55°C ~ 150°C (TJ); Package / Case: TO-236-3, SC-59, SOT-23-3; Packaging: TapeAndReel; Part Status: Active; Price: 0.10; Series: -; Supplier 1: DigiKey; Supplier Part Number 1: NTR4171PT1GOSCT-ND; Supplier Device Package: SOT-23-3 (TO-236); Technology: MOSFET (Metal Oxide)
IC3 = NTR3C21NZT1G: MOSFET N-CH 20V 3.6A SOT23-3; Manufacturer: ON Semiconductor; Current - Continuous Drain (Id) @ 25°C: 3.6A (Ta); Drive Voltage (Max Rds On,  Min Rds On): 1.8V, 4.5V; FET Type: N-Channel; Gate Charge (Qg) (Max) @ Vgs: 17.8nC @ 4.5V; Input Capacitance (Ciss) (Max) @ Vds: 1540pF @ 16V; Power Dissipation (Max): 470mW (Ta); Rds On (Max) @ Id, Vgs: 24mOhm @ 5A, 4.5V; Vgs (Max): ±8V; Vgs(th) (Max) @ Id: 1V @ 250µA; Part Number: NTR3C21NZT1G; ComponentLink1Description: Datasheet; ComponentLink1URL: http://www.onsemi.com/pub/Collateral/NTR3C21NZ-D.PDF; ComponentLink2Description: DigiKey Link; ComponentLink2URL: http://digikey.com/product-detail/en/on-semiconductor/NTR3C21NZT1G/NTR3C21NZT1GOSCT-ND/9087577; Drain to Source Voltage (Vdss): 20V; LastUpdated: 08.02.2024 21:46:18; Lifecycle Status: Active; Minimum Order: 1; Mounting Type: Surface Mount; Operating Temperature: -55°C ~ 150°C (TJ); Package / Case: TO-236-3, SC-59, SOT-23-3; Packaging: TapeAndReel; Part Status: Active; Price: 0.10; Series: -; Supplier 1: DigiKey; Supplier Part Number 1: NTR3C21NZT1GOSCT-ND; Supplier Device Package: SOT-23-3 (TO-236); Technology: MOSFET (Metal Oxide)
IC4 = CMP-13577-000002-2: TVOC IAQ INTEGRATED SENSOR; NexarPartId: 106944004; Min Supply Voltage: 1.7V; Max Supply Voltage: 3.6V; Width: 3mm; Min Operating Temperature: -40°C; Max Operating Temperature: 65°C; RoHS: Non-Compliant; Height: 770µm; Thickness: 700µm; Length: 3mm; Ambient Temperature Range High: 65°C; Number of Pins: 12
J1 = CMP-245163-000001-1: CONN RCPT USB2.0 TYPEC 5A; Manufacturer: GCT; Voltage Rating: 20V; Is Female: yes; Current Rating: 5/6.25/1.25/0.25A; Number Of Contacts: 16; Conn Orientation: Right Angle; Device Class L1: Connectors; Category: Conn; Lead Free: Yes; RoHS: TRUE; Temperature Range High: +85°C; Digikey Description: CONN RCPT USB2.0 TYPEC 5A; Device Class L3: unset; ComponentLink2Description: Datasheet; Manufacturer Part Number: USB4105-GF-A; Package: 0; Usb Standard: USB 2.0; Device Class L2: USB Connectors; Automotive: No; Temperature Range Low: -40°C; Height: 3.46mm; Temperature: -40°C to +85°C; Contact Material: Gold,Nickel; ComponentLink2URL: https://gct.co/files/drawings/usb4105.pdf; Octopart: https://octopart.com/usb4105-gf-a-gct-106627878
J2 = CMP-11597-000004-1: CONN MICRO SD CARD PUSH-PUSH R/A; Connector Type: Connector; Pitch: 1.1mm; Insulation Resistance: 1GR; Contact Resistance: 100mR; Number of Positions: 8; Max Voltage Rating (AC): 125V; Gender: Female; Current Rating: 500mA; Flammability Rating: UL94 V-0; Min Operating Temperature: -25°C; Lead Free: Lead Free; Length: 13.85mm; Radiation Hardening: No; Orientation: Right Angle; Mount: Surface Mount; Housing Material: Polymer; Contact Material: Copper Alloy; Package Quantity: 1; Contact Plating: Gold; Termination: Solder; Max Operating Temperature: 85°C; Number of Contacts: 8; Voltage Rating (AC): 125V; REACH SVHC: No SVHC; Depth: 1.83mm; Max Current Rating: 500mA; Width: 16.05mm; Number of Rows: 1; Packaging: Tape and Reel
J3 = M20-9960245: CONN HEADER R/A 2POS 2.54MM; Manufacturer: Harwin Inc.; Connector Type: Header, Cuttable; Contact Length - Mating: 0.240" (6.10mm); Contact Length - Post: 0.118" (3.00mm); Current Rating (Amps): 3A per Contact; Material Flammability Rating: UL94 V-0; Number of Positions: 2; Number of Positions Loaded: All; Pitch - Mating: 0.100" (2.54mm); Row Spacing - Mating: -40°C ~ 105°C; Shrouding: Unshrouded; Style: Board to Board or Cable; Part Number: M20-9960245; ComponentLink1Description: Datasheet; ComponentLink1URL: https://cdn.harwin.com/pdfs/Harwin_PC_Connectors_M20.pdf; ComponentLink2Description: DigiKey Link; ComponentLink2URL: https://www.digikey.com/en/products/detail/harwin-inc/M20-9960245/3728208; Contact Finish - Mating: Gold; Contact Material: Brass; Contact Shape: Square; Contact Type: Male Pin; Fastening Type: Push-Pull; Insulation Color: Black; Insulation Height: 0.100" (2.54mm); Insulation Material: Polyamide (PA6T), Nylon 6T; LastUpdated: 21.09.2022 19:22:55; Lifecycle Status: Active; Minimum Order: 1; Mounting Type: Through Hole, Right Angle; Number of Rows: 1; Operating Temperature: -40°C ~ 105°C; Packaging: Bulk; PartId: 165; Part Status: Active; Price: 0.07; Series: M20; Supplier 1: DigiKey; Supplier Part Number 1: 952-2244-ND; Termination: Solder
L2 = DFE201612E-2R2M=P2: FIXED IND 2.2UH 1.8A 116MOHM SMD; Manufacturer: Murata Electronics; DC Resistance (DCR): 116mOhm Max; Inductance Frequency - Test: 1 MHz; Material - Core: Metal; Shielding: Shielded; Tolerance: ±20%; Type: Drum Core, Wirewound; Part Number: DFE201612E-2R2M=P2; ComponentLink1Description: Datasheet; ComponentLink1URL: https://search.murata.co.jp/Ceramy/image/img/P02/J(E)TE243A-0006.pdf; ComponentLink2Description: DigiKey Link; ComponentLink2URL: https://www.digikey.com/en/products/detail/murata-electronics/DFE201612E-2R2M-P2/9815901; Current Rating (Amps): 1.8 A; Device Package: 0806 (2016 Metric); Height - Seated (Max): 0.047" (1.20mm); Inductance: 2.2 µH; LastUpdated: 08.02.2024 21:45:16; Lifecycle Status: Active; Minimum Order: 1; Mounting Type: Surface Mount; Operating Temperature: -40°C ~ 125°C; Package / Case: 0806 (2016 Metric); Packaging: TapeAndReel; PartId: 5399; Part Status: Active; Price: 0.11; Series: DFE201612E; Size / Dimension: 0.079" L x 0.063" W (2.00mm x 1.60mm); Supplier 1: DigiKey; Supplier Part Number 1: 490-DFE201612E-2R2M=P2CT-ND; Supplier Device Package: 0806; Value: 2.2 µH
R2-R4 R9 R10 = RT0603FRE0710KL: as R1 on sheet MCU; Part Number: RT0603FRE0710KL; Value: 10 kOhms; ComponentLink1Description: Datasheet; ComponentLink1URL: https://www.yageo.com/upload/media/product/productsearch/datasheet/rchip/PYu-RT_1-to-0.01_RoHS_L_11.pdf; ComponentLink2Description: DigiKey Link; ComponentLink2URL: https://www.digikey.com/en/products/detail/yageo/RT0603FRE0710KL/1075040; Composition: Thin Film; Device Package: 0603 (1608 Metric); Height - Seated (Max): 0.022" (0.55mm); LastUpdated: 15.01.2024 20:40:25; Lifecycle Status: Active; Minimum Order: 1; Number of Terminations: 2; Operating Temperature: -55°C ~ 155°C; Package / Case: 0603 (1608 Metric); Packaging: TapeAndReel; PartId: 5671; Part Status: Active; Price: 0.01; Resistance: 10 kOhms; Series: RT; Size / Dimension: 0.063" L x 0.031" W (1.60mm x 0.80mm); Supplier 1: DigiKey; Supplier Part Number 1: YAG2321CT-ND; Supplier Device Package: 0603; Tolerance: ±1%
R7 R12 R15-R17 = JR0603X26E: as R5 on sheet MCU; Part Number: JR0603X26E; Value: 0 Ohms; ComponentLink1Description: Datasheet; ComponentLink1URL: https://www.ohmite.com/assets/docs/res_jr.pdf?r=false; ComponentLink2Description: DigiKey Link; ComponentLink2URL: https://www.digikey.com/en/products/detail/ohmite/JR0603X26E/10233371; Composition: Metal Element; Device Package: 0603 (1608 Metric); Height - Seated (Max): 0.022" (0.55mm); LastUpdated: 15.01.2024 20:40:20; Lifecycle Status: Active; Minimum Order: 1; Number of Terminations: 2; Operating Temperature: -55°C ~ 150°C; Package / Case: 0603 (1608 Metric); Packaging: TapeAndReel; PartId: 6812; Part Status: Active; Price: 0.10; Resistance: 0 Ohms; Series: JR; Size / Dimension: 0.063" L x 0.031" W (1.60mm x 0.80mm); Supplier 1: DigiKey; Supplier Part Number 1: JR0603X26ECT-ND; Supplier Device Package: 0603; Tolerance: Jumper
R11 R13 = TNPW060310K0FHTA: RES 10K OHM 1% 1/10W 0603; Manufacturer: Vishay Dale; Power (Watts): 0.1W, 1/10W; Temperature Coefficient: ±50ppm/°C; Part Number: TNPW060310K0FHTA; Value: 10 kOhms; ComponentLink2Description: DigiKey Link; ComponentLink2URL: https://www.digikey.com/en/products/detail/vishay-dale/TNPW060310K0FHTA/7354881; Composition: Thin Film; Device Package: 0603 (1608 Metric); Features: Military; Height - Seated (Max): 0.022" (0.55mm); LastUpdated: 09.02.2024 20:43:19; Lifecycle Status: Active; Minimum Order: 1; Number of Terminations: 2; Operating Temperature: -55°C ~ 125°C; Package / Case: 0603 (1608 Metric); Packaging: TapeAndReel; PartId: 9361; Part Status: Active; Price: 0.09; Resistance: 10 kOhms; Series: TNPW; Size / Dimension: 0.063" L x 0.033" W (1.60mm x 0.85mm); Supplier 1: DigiKey; Supplier Part Number 1: 541-3906-1-ND; Supplier Device Package: 0603; Tolerance: ±1%
R14 = RMCF0603FT3K09: RES 3.09K OHM 1% 1/10W 0603; Manufacturer: Stackpole Electronics Inc; Power (Watts): 0.1W, 1/10W; Temperature Coefficient: ±100ppm/°C; Part Number: RMCF0603FT3K09; Value: 3.09 kOhms; ComponentLink1Description: Datasheet; ComponentLink1URL: https://www.seielect.com/catalog/sei-rmcf_rmcp.pdf; ComponentLink2Description: DigiKey Link; ComponentLink2URL: https://www.digikey.com/en/products/detail/stackpole-electronics-inc/RMCF0603FT3K09/1761340; Composition: Thick Film; Device Package: 0603 (1608 Metric); Features: Automotive AEC-Q200; Height - Seated (Max): 0.022" (0.55mm); LastUpdated: 15.01.2024 20:39:25; Lifecycle Status: Active; Minimum Order: 1; Number of Terminations: 2; Operating Temperature: -55°C ~ 155°C; Package / Case: 0603 (1608 Metric); Packaging: CutTape; PartId: 20368; Part Status: Active; Price: 0.01; Ratings: AEC-Q200; Resistance: 3.09 kOhms; Series: RMCF; Size / Dimension: 0.061" L x 0.031" W (1.55mm x 0.80mm); Supplier 1: DigiKey; Supplier Part Number 1: RMCF0603FT3K09CT-ND; Supplier Device Package: 0603; Tolerance: ±1%
R18 = RMCF0603JG1K80: RES 1.8K OHM 5% 1/10W 0603; Manufacturer: Stackpole Electronics Inc; Power (Watts): 0.1W, 1/10W; Temperature Coefficient: ±200ppm/°C; Part Number: RMCF0603JG1K80; Value: 1.8 kOhms; ComponentLink1Description: Datasheet; ComponentLink1URL: https://www.seielect.com/catalog/sei-packaging.pdf; ComponentLink2Description: DigiKey Link; ComponentLink2URL: https://www.digikey.com/en/products/detail/stackpole-electronics-inc/RMCF0603JG1K80/1712125; Composition: Thick Film; Device Package: 0603 (1608 Metric); Features: Automotive AEC-Q200; Height - Seated (Max): 0.022" (0.55mm); LastUpdated: 15.01.2024 20:39:16; Lifecycle Status: Active; Minimum Order: 1; Number of Terminations: 2; Operating Temperature: -55°C ~ 155°C; Package / Case: 0603 (1608 Metric); Packaging: CutTape; PartId: 22440; Part Status: Active; Price: 0.01; Ratings: AEC-Q200; Resistance: 1.8 kOhms; Series: RMCF; Size / Dimension: 0.061" L x 0.031" W (1.55mm x 0.80mm); Supplier 1: DigiKey; Supplier Part Number 1: RMCF0603JG1K80CT-ND; Supplier Device Package: 0603; Tolerance: ±5%
R20 R21 R27 R28 = TNPW06034K70BEEN: RES 4.7K OHM 0.1% 1/10W 0603; Manufacturer: Vishay Dale; Power (Watts): 0.1W, 1/10W; Temperature Coefficient: ±25ppm/°C; Part Number: TNPW06034K70BEEN; Value: 4.7 kOhms; ComponentLink1Description: Datasheet; ComponentLink1URL: http://www.vishay.com/docs/28758/tnpw_e3.pdf; ComponentLink2Description: DigiKey Link; ComponentLink2URL: https://www.digikey.com/en/products/detail/vishay-dale/TNPW06034K70BEEN/1610049; Composition: Thin Film; Device Package: 0603 (1608 Metric); Features: Anti-Sulfur, Automotive AEC-Q200, Moisture Resistant; Height - Seated (Max): 0.022" (0.55mm); LastUpdated: 09.02.2024 20:42:39; Lifecycle Status: Active; Minimum Order: 1; Number of Terminations: 2; Operating Temperature: -55°C ~ 155°C; Package / Case: 0603 (1608 Metric); Packaging: TapeAndReel; PartId: 19608; Part Status: Active; Price: 0.14; Ratings: AEC-Q200; Resistance: 4.7 kOhms; Series: TNPW e3; Size / Dimension: 0.063" L x 0.033" W (1.60mm x 0.85mm); Supplier 1: DigiKey; Supplier Part Number 1: 541-3689-1-ND; Supplier Device Package: 0603; Tolerance: ±0.1%
R24 R25 = RR0816P-512-D: RES SMD 5.1K OHM 0.5% 1/16W 0603; Manufacturer: Susumu; Power (Watts): 0.063W, 1/16W; Temperature Coefficient: ±25ppm/°C; Part Number: RR0816P-512-D; Value: 5.1 kOhms; ComponentLink1Description: Datasheet; ComponentLink1URL: http://www.susumu.co.jp/common/pdf/n_catalog_partition05_en.pdf; ComponentLink2Description: DigiKey Link; ComponentLink2URL: https://www.digikey.com/en/products/detail/susumu/RR0816P-512-D/432202; Composition: Thin Film; Device Package: 0603 (1608 Metric); Height - Seated (Max): 0.020" (0.50mm); LastUpdated: 15.01.2024 20:39:40; Lifecycle Status: Active; Minimum Order: 1; Number of Terminations: 2; Operating Temperature: -55°C ~ 125°C; Package / Case: 0603 (1608 Metric); Packaging: TapeAndReel; PartId: 16877; Part Status: Active; Price: 0.01; Resistance: 5.1 kOhms; Series: RR; Size / Dimension: 0.063" L x 0.031" W (1.60mm x 0.80mm); Supplier 1: DigiKey; Supplier Part Number 1: RR08P5.1KDCT-ND; Supplier Device Package: 0603; Tolerance: ±0.5%
R26 = RC0603FR-1052K3L: RES 52.3K OHM 1% 1/10W 0603; Manufacturer: Yageo; Power (Watts): 0.1W, 1/10W; Temperature Coefficient: ±100ppm/°C; Part Number: RC0603FR-1052K3L; Value: 52.3 kOhms; ComponentLink1Description: Datasheet; ComponentLink1URL: https://www.yageo.com/upload/media/product/productsearch/datasheet/rchip/PYu-RC_Group_51_RoHS_L_11.pdf; ComponentLink2Description: DigiKey Link; ComponentLink2URL: https://www.digikey.com/en/products/detail/yageo/RC0603FR-1052K3L/14008206; Composition: Thick Film; Device Package: 0603 (1608 Metric); Height - Seated (Max): 0.022" (0.55mm); LastUpdated: 15.01.2024 20:38:08; Lifecycle Status: Active; Minimum Order: 1; Number of Terminations: 2; Operating Temperature: -55°C ~ 155°C; Package / Case: 0603 (1608 Metric); Packaging: CutTape; PartId: 65325; Part Status: Active; Price: 0.01; Resistance: 52.3 kOhms; Series: RC_L; Size / Dimension: 0.063" L x 0.031" W (1.60mm x 0.80mm); Supplier 1: DigiKey; Supplier Part Number 1: 13-RC0603FR-1052K3LCT-ND; Supplier Device Package: 0603; Tolerance: ±1%
U1 = CMP-0321-00214-2: USB-Friendly Li-Ion Battery Charger and Power-Path Management IC, Vout 4.4 V, 4.3 V, -40 to 85 degC, 16-pin QFN (RGT), Green (RoHS & no Sb/Br); Manufacturer: Texas Instruments; Over Voltage Protection: N; SubFamily: Battery Charge Management; Vin(Min)(V): 4.3; Mounting Technology: Surface Mount; Lead Acid: N; NiCd: N; Eco-Plan: Green (RoHS & no Sb/Br); Code_JEDEC: MO-220; ComponentLink1Description: Datasheet; DatasheetVersion: SLUS810G; NiMH: N; PackageReference: RGT0016C; PartNumber: BQ24073RGTT; ComponentLink1URL: http://www.ti.com/general/docs/lit/getliterature.tsp?genericPartNumber=BQ24073&fileType=pdf; PackageDescription: 16-Pin Plastic Quad Flat No-Lead, 3 x 3 mm Body, 0.5 mm Pitch, 1.7 x 1.7 mm Exposed Pad; Li-Polymer: N; PackageVersion: revH, Oct-2011; Li-Ion: N
U2 = CMP-18409-000003-1: SENSOR OPT 550NM AMBIENT 6SMD; Manufacturer: Broadcom; Sensor Output: I2C; Max Supply Voltage: 3.6V; Min Supply Voltage: 1.7V; Operating Supply Current: 130uA; Height: 0.75mm; Mouser Description: Digital RGB IR and Ambient Light Sensor with I2C Output; Ambient Temperature Range Low: -40°C; Temperature: -40°C to +85°C; Lead Free: Yes; Temperature Range High: +85°C; Device Class L3: unset; Package: 0; ComponentLink2URL: https://docs.broadcom.com/doc/AV02-4733EN; Ambient Temperature Range High: +85°C; Temperature Range Low: -40°C; Octopart: https://octopart.com/apds-9250-broadcom-71127178; Device Class L1: Sensors; Automotive: No; RoHS: TRUE; Ipc Land Pattern Name: DFN200X200X65-6; Digikey Description: SENSOR OPT 550NM AMBIENT 6SMD; ComponentLink2Description: Datasheet; Category: IC; Device Class L2: Optical Sensors; Manufacturer Part Number: APDS-9250
U4 = CMP-04918-000211-1: STEP DOWN CONVERTER; RoHS Compliant: Yes
U5 = CMP-2000-05073-3: SENSOR PRESSURE HUMIDITY TEMP; Sensor Type: Temperature; Accuracy: 3%; Response Time: 1s; Output Type: SPI; Min Operating Temperature: -40°C; Max Operating Temperature: 85°C; Case/Package: LGA; Packaging: Cut Tape; Mount: Surface Mount; Lead Free: Lead Free; Number of Pins: 8

## Nets that join several sheets
GND: MCU (29 pins), peripherals (42 pins)
VCC33: MCU (14 pins), peripherals (5 pins)
INT: MCU (IC1.9), peripherals (R28.2 U2.4)
INT_G: MCU (IC1.18), peripherals (IC4.3 R21.2)
NetIC1_8: MCU (IC1.8), peripherals (U5.3)
NetIC1_12: MCU (IC1.12), peripherals (U5.4)
NetIC1_13: MCU (IC1.13), peripherals (U5.5)
NetIC1_19: MCU (IC1.19), peripherals (IC4.11)
NetIC1_21: MCU (IC1.21), peripherals (IC3.1 R13.2)
NetIC1_22: MCU (IC1.22), peripherals (U5.2)
NetIC1_23: MCU (IC1.23), peripherals (J2.3 R10.1)
NetIC1_24: MCU (IC1.24), peripherals (J2.5)
NetIC1_25: MCU (IC1.25), peripherals (J2.7 R2.1)
NetIC1_26: MCU (IC1.26), peripherals (J2.8 R3.1)
NetIC1_27: MCU (IC1.27), peripherals (J2.1 R4.1)
NetIC1_28: MCU (IC1.28), peripherals (J2.2 R9.1)
SCL: MCU (IC1.11), peripherals (IC4.1 R20.2 U2.1)
SDA: MCU (IC1.10), peripherals (IC4.2 R27.2 U2.2)
USB_N: MCU (D1.2 R8.2), peripherals (J1.A7 J1.B7)
USB_P: MCU (D1.3 R5.1), peripherals (J1.A6 J1.B6)
VBUS: MCU (D1.4), peripherals (C18.2 J1.A4-B9 J1.B4-A9 U1.13)

## Assembly variants
TBD: not fitted D? L2 R7